# EAGLE design gamby-prototype2 (EAGLE 5.11)
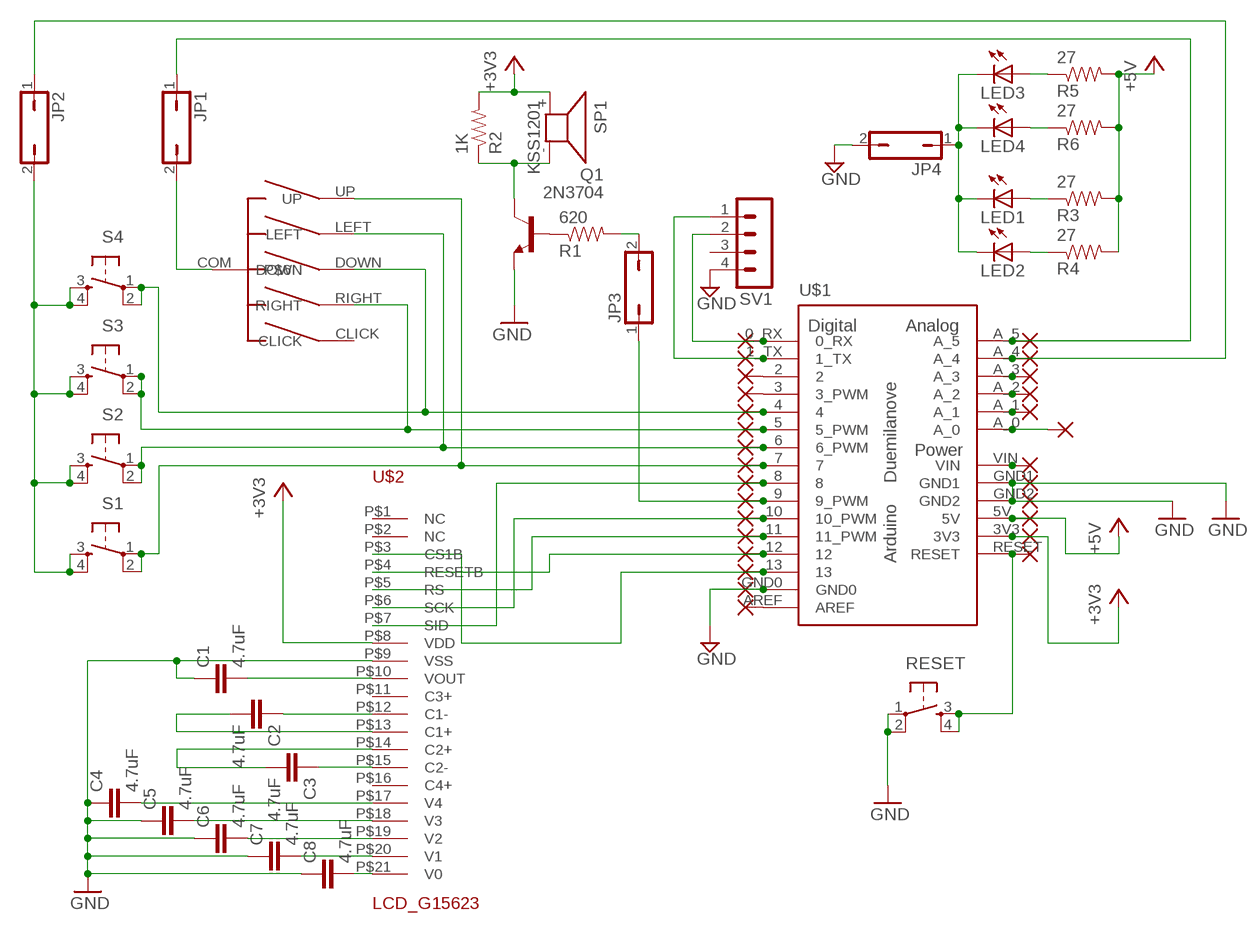
[diagram p0: schematic, sheet 1]

## Parts
C1  4.7uF  C2.5/2  [C2.5-2]
C2  4.7uF  C2.5/2  [C2.5-2]
C3  4.7uF  C2.5/2  [C2.5-2]
C4  4.7uF  C2.5/2  [C2.5-2]
C5  4.7uF  C2.5/2  [C2.5-2]
C6  4.7uF  C2.5/2  [C2.5-2]
C7  4.7uF  C2.5/2  [C2.5-2]
C8  4.7uF  C2.5/2  [C2.5-2]
JP1  JP1Q  [JP1]
JP2  JP1Q  [JP1]
JP3  JP1Q  [JP1]
JP4  JP1Q  [JP1]
LED1  LEDSMT1206  [1206]
LED2  LEDSMT1206  [1206]
LED3  LEDSMT1206  [1206]
LED4  LEDSMT1206  [1206]
PAD_3V3  1,6/0,8  [1,6/0,8]
PAD_5V  1,6/0,8  [1,6/0,8]
PAD_A0  1,6/0,8  [1,6/0,8]
PAD_A1  1,6/0,8  [1,6/0,8]
PAD_A2  1,6/0,8  [1,6/0,8]
PAD_A3  1,6/0,8  [1,6/0,8]
PAD_A4  1,6/0,8  [1,6/0,8]
PAD_A5  1,6/0,8  [1,6/0,8]
PAD_AREF  1,6/0,8  [1,6/0,8]
PAD_D2  1,6/0,8  [1,6/0,8]
PAD_D3  1,6/0,8  [1,6/0,8]
PAD_D4  1,6/0,8  [1,6/0,8]
PAD_D5  1,6/0,8  [1,6/0,8]
PAD_D6  1,6/0,8  [1,6/0,8]
PAD_D7  1,6/0,8  [1,6/0,8]
PAD_D8  1,6/0,8  [1,6/0,8]
PAD_D9  1,6/0,8  [1,6/0,8]
PAD_D10  1,6/0,8  [1,6/0,8]
PAD_D11  1,6/0,8  [1,6/0,8]
PAD_D12  1,6/0,8  [1,6/0,8]
PAD_D13  1,6/0,8  [1,6/0,8]
PAD_GND0  1,6/0,8  [1,6/0,8]
PAD_GND1  1,6/0,8  [1,6/0,8]
PAD_GND2  1,6/0,8  [1,6/0,8]
PAD_RESET  1,6/0,8  [1,6/0,8]
PAD_RX  1,6/0,8  [1,6/0,8]
PAD_TX  1,6/0,8  [1,6/0,8]
PAD_VIN  1,6/0,8  [1,6/0,8]
Q1  2N3704  [TO92]
R1  620  RESISTORPTH1  [AXIAL-0.3]
R2  1K  RESISTORPTH1  [AXIAL-0.3]
R3  27  RESISTORPTH1  [AXIAL-0.3]
R4  27  RESISTORPTH1  [AXIAL-0.3]
R5  27  RESISTORPTH1  [AXIAL-0.3]
R6  27  RESISTORPTH1  [AXIAL-0.3]
RESET  TAC_SWITCHPTH  [TACTILE-PTH]
S1  TAC_SWITCHPTH  [TACTILE-PTH]
S2  TAC_SWITCHPTH  [TACTILE-PTH]
S3  TAC_SWITCHPTH  [TACTILE-PTH]
S4  TAC_SWITCHPTH  [TACTILE-PTH]
SP1  KSS1201  [KSS1201]
SV1  MA04-1  [MA04-1]
U$1  ARDUINO-USBLONG_PADS_TEXT  [SHIELD]
U$2  LCD_G15623  [LCD_G15623]
U$3  DEV1  [DIP]

## Nets
0_RX: PAD_RX.1(P) SV1.2 U$1.0_RX
1_TX: PAD_TX.1(P) SV1.1 U$1.1_TX
+3V3: PAD_3V3.1(P) R2.P$2 SP1.+ U$1.3V3 U$2.P$8(VDD)
+5V: PAD_5V.1(P) R3.P$2 R4.P$2 R5.P$2 R6.P$2 U$1.5V
A0: PAD_A0.1(P) U$1.A_0
A4_BUTTONS: JP2.1 PAD_A4.1(P) U$1.A_4
A5_DPAD: JP1.1 PAD_A5.1(P) U$1.A_5
BUTTON_A: PAD_D7.1(P) S1.1 S1.2 U$1.7 U$3.UP
D2: PAD_D4.1(P) S4.1 S4.2 U$1.4 U$3.DOWN
D3: JP3.1 PAD_D9.1(P) U$1.9(9_PWM)
D4: PAD_D5.1(P) S3.1 S3.2 U$1.5(5_PWM) U$3.RIGHT
D5: PAD_D6.1(P) S2.1 S2.2 U$1.6(6_PWM) U$3.LEFT
GND: C1.1 C4.1 C5.1 C6.1 C7.1 C8.1 JP4.2 PAD_GND0.1(P) PAD_GND1.1(P) PAD_GND2.1(P) Q1.3(E) RESET.1 RESET.2 SV1.4 U$1.GND0 U$1.GND1 U$1.GND2 U$2.P$9(VSS)
N$1: PAD_D8.1(P) U$1.8 U$2.P$7(SID)
N$2: PAD_D10.1(P) U$1.10(10_PWM) U$2.P$6(SCK)
N$3: PAD_D11.1(P) U$1.11(11_PWM) U$2.P$5(RS)
N$4: PAD_D12.1(P) U$1.12 U$2.P$4(RESETB)
N$5: LED1.A R3.P$1
N$6: JP1.2 U$3.COM
N$7: LED2.A R4.P$1
N$8: JP4.1 LED1.C LED2.C LED3.C LED4.C
N$9: LED4.A R6.P$1
N$13: PAD_VIN.1(P) U$1.VIN
N$15: Q1.2(C) R2.P$1 SP1.-
N$17: Q1.1(B) R1.P$1
N$18: PAD_D3.1(P) U$1.3(3_PWM)
N$20: JP3.2 R1.P$2
N$21: C7.2 U$2.P$20(V1)
N$22: C5.2 U$2.P$18(V3)
N$23: C8.2 U$2.P$21(V0)
N$24: C4.2 U$2.P$17(V4)
N$25: PAD_D13.1(P) U$1.13 U$2.P$3(CS1B)
N$26: C6.2 U$2.P$19(V2)
N$28: PAD_D2.1(P) U$1.2
N$29: C3.1 U$2.P$15(C2-)
N$30: C3.2 U$2.P$14(C2+)
N$32: C2.2 U$2.P$13(C1+)
N$33: C2.1 U$2.P$12(C1-)
N$35: PAD_A1.1(P) U$1.A_1
N$36: C1.2 U$2.P$10(VOUT)
N$37: LED3.A R5.P$1
N$42: PAD_RESET.1(P) RESET.3 RESET.4 U$1.RESET
N$43: PAD_A2.1(P) U$1.A_2
N$44: PAD_A3.1(P) U$1.A_3
N$45: JP2.2 S1.3 S1.4 S2.3 S2.4 S3.3 S3.4 S4.3 S4.4
N$49: PAD_AREF.1(P) U$1.AREF
Unconnected: SV1.3 U$2.P$1(NC) U$2.P$2(NC) U$2.P$11(C3+) U$2.P$16(C4+) U$3.CLICK

## Library data of the parts
C1-C8 = capacitor-wima:C: CAPACITOR naming: grid - package width
JP1-JP4 = jumper:JP1Q: JUMPER
LED1-LED4 = led:LED: LED OSRAM: - CHIPLED LG R971, LG N971, LY N971, LG Q971, LY Q971, LO R971, LY R971 LH N974, LH R974 LS Q976, LO Q976, LY Q976 LO Q996 - Hyper CHIPLED LW Q18S LB Q993, LB Q99A, LB R99A - SideLED LS A670, LO A670, LY A670, LG A670, LP A670 LB A673, LV A673, LT A673, LW A673 LH A674 LY A675 LS A676, LA A676, LO A676, LY A676, LW A676 LS A679, LY A679, LG A679 - Hyper Micro SIDELED® LS Y876, LA Y876, LO Y876, LY Y876 LT Y87S - SmartLED LW L88C, LW L88S LB L89C, LB L89S, LG L890 LS L89K, LO L89K, LY L89K LS L896, LA L896, LO L896, LY L896 - TOPLED LS T670, LO T670, LY T670, LG T670, LP T670 LSG T670, LSP T670, LSY T670, LOP T670, LYG T670 LG T671, LOG T671, LSG T671 LB T673, LV T673, LT T673, LW T673 LH T674 LS T676, LA T676, LO T676, LY T676, LB T676, LH T676, LSB T676, LW T676 LB T67C, LV T67C, LT T67C, LS T67K, LO T67K, LY T67K, LW E67C LS E67B, LA E67B, LO E67B, LY E67B, LB E67C, LV E67C, LT E67C LW T67C LS T679, LY T679, LG T679 LS T770, LO T770, LY T770, LG T770, LP T770 LB T773, LV T773, LT T773, LW T773 LH T774 LS E675, LA E675, LY E675, LS T675 LS T776, LA T776, LO T776, LY T776, LB T776 LHGB T686 LT T68C, LB T68C - Hyper Mini TOPLED® LB M676 - Mini TOPLED Santana® LG M470 LS M47K, LO M47K, LY M47K Source: http://www.osram.convergy.de LUXEON: - LUMILED® LXK2-PW12-R00, LXK2-PW12-S00, LXK2-PW14-U00, LXK2-PW14-V00 LXK2-PM12-R00, LXK2-PM12-S00, LXK2-PM14-U00 LXK2-PE12-Q00, LXK2-PE12-R00, LXK2-PE12-S00, LXK2-PE14-T00, LXK2-PE14-U00 LXK2-PB12-K00, LXK2-PB12-L00, LXK2-PB12-M00, LXK2-PB14-N00, LXK2-PB14-P00, LXK2-PB14-Q00 LXK2-PR12-L00, LXK2-PR12-M00, LXK2-PR14-Q00, LXK2-PR14-R00 LXK2-PD12-Q00, LXK2-PD12-R00, LXK2-PD12-S00 LXK2-PH12-R00, LXK2-PH12-S00 LXK2-PL12-P00, LXK2-PL12-Q00, LXK2-PL12-R00 Source: www.luxeon.com KINGBRIGHT: KA-3528ASYC Source: www.kingbright.com
PAD_3V3 PAD_5V PAD_A0 PAD_A1-PAD_A5 PAD_AREF PAD_D2-PAD_D13 PAD_GND0 PAD_GND1 PAD_GND2 PAD_RESET PAD_RX PAD_TX PAD_VIN = wirepad:1,6/0,8: THROUGH-HOLE PAD
Q1 = transistor:2N3704: NPN TRANSISTOR
R1-R6 = SparkFun:RESISTOR: Resistor Basic schematic elements and footprints for 0603, 1206, and PTH 1/10th watt (small) resistors.
RESET S1-S4 = SparkFun:TAC_SWITCH: Momentary Switch Button commonly used for reset or general input. Spark Fun Electronics SKU : COM-00097
SP1 = buzzer:KSS1201: SPEAKER Source: Schukat
SV1 = con-lstb:MA04-1: PIN HEADER; OC_FARNELL: unknown; OC_NEWARK: unknown
U$1 = Arduino-Various:ARDUINO-USB: The Ardiuno Duemilanove Pinouts layoutet as a Bare Shield. v0.5 Also for Arduino Diecimila. This is designed as a Part and has no Outline in the Dimension Layer. The Outline, when present, is drawed at the tPlace / bPlace Layer. Library by Stephanie Lange, http://www.k-ita.de/~sl/
U$2 = goldlcd:LCD_G15623
U$3 = alps-5wayswitch:DEV1

## Board
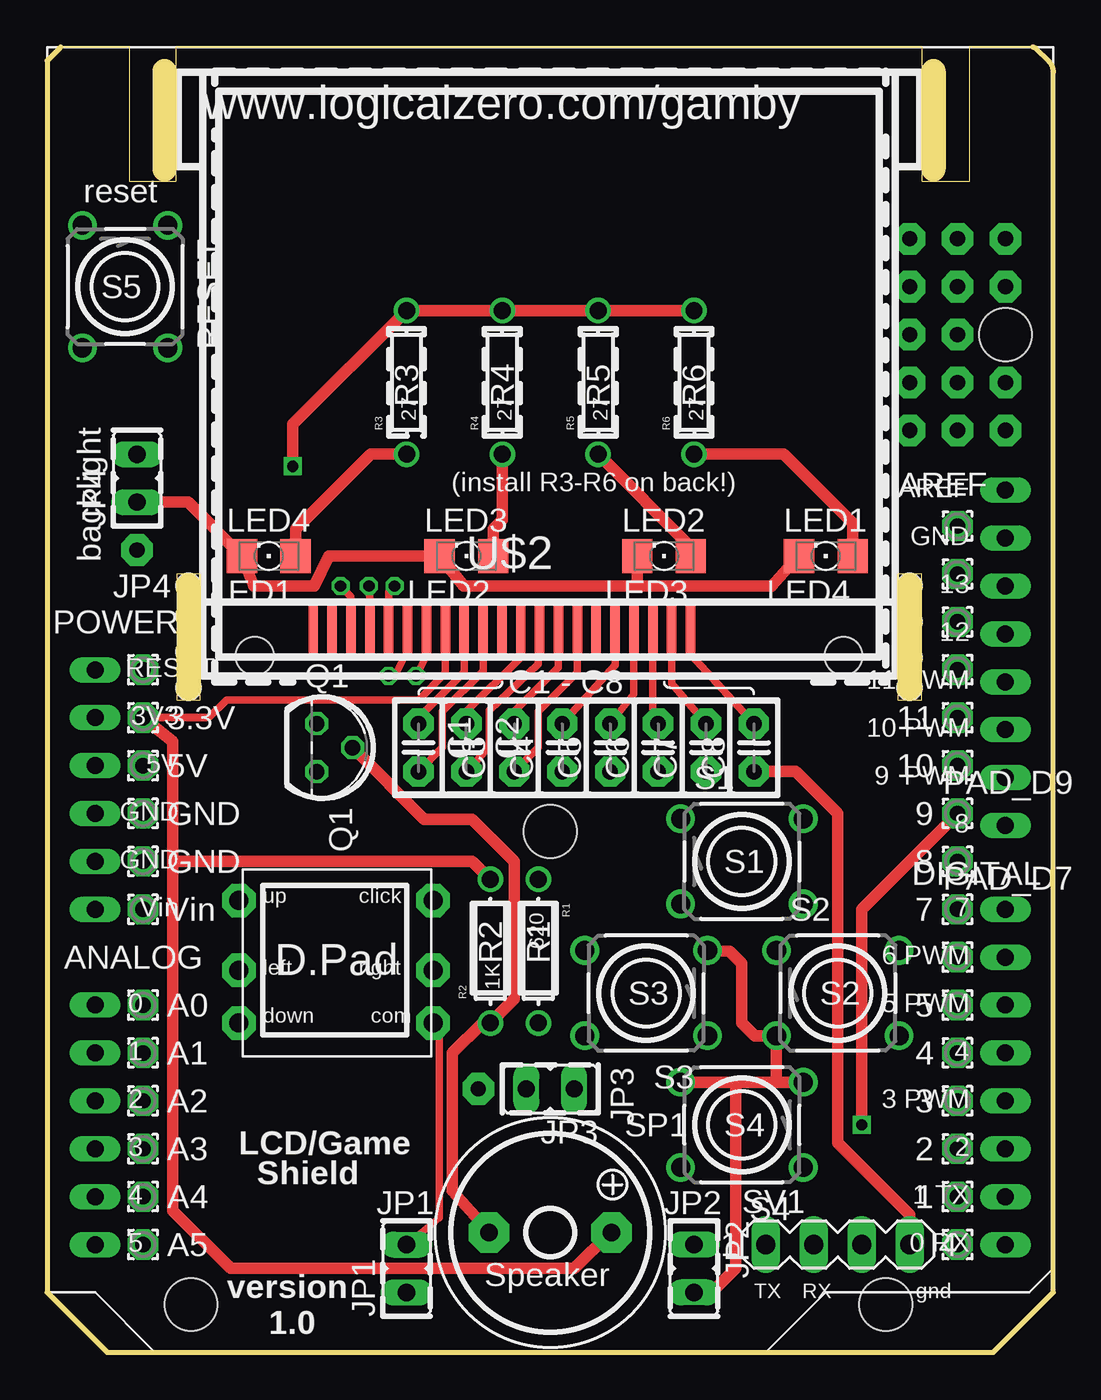
[diagram p1: board, top side]
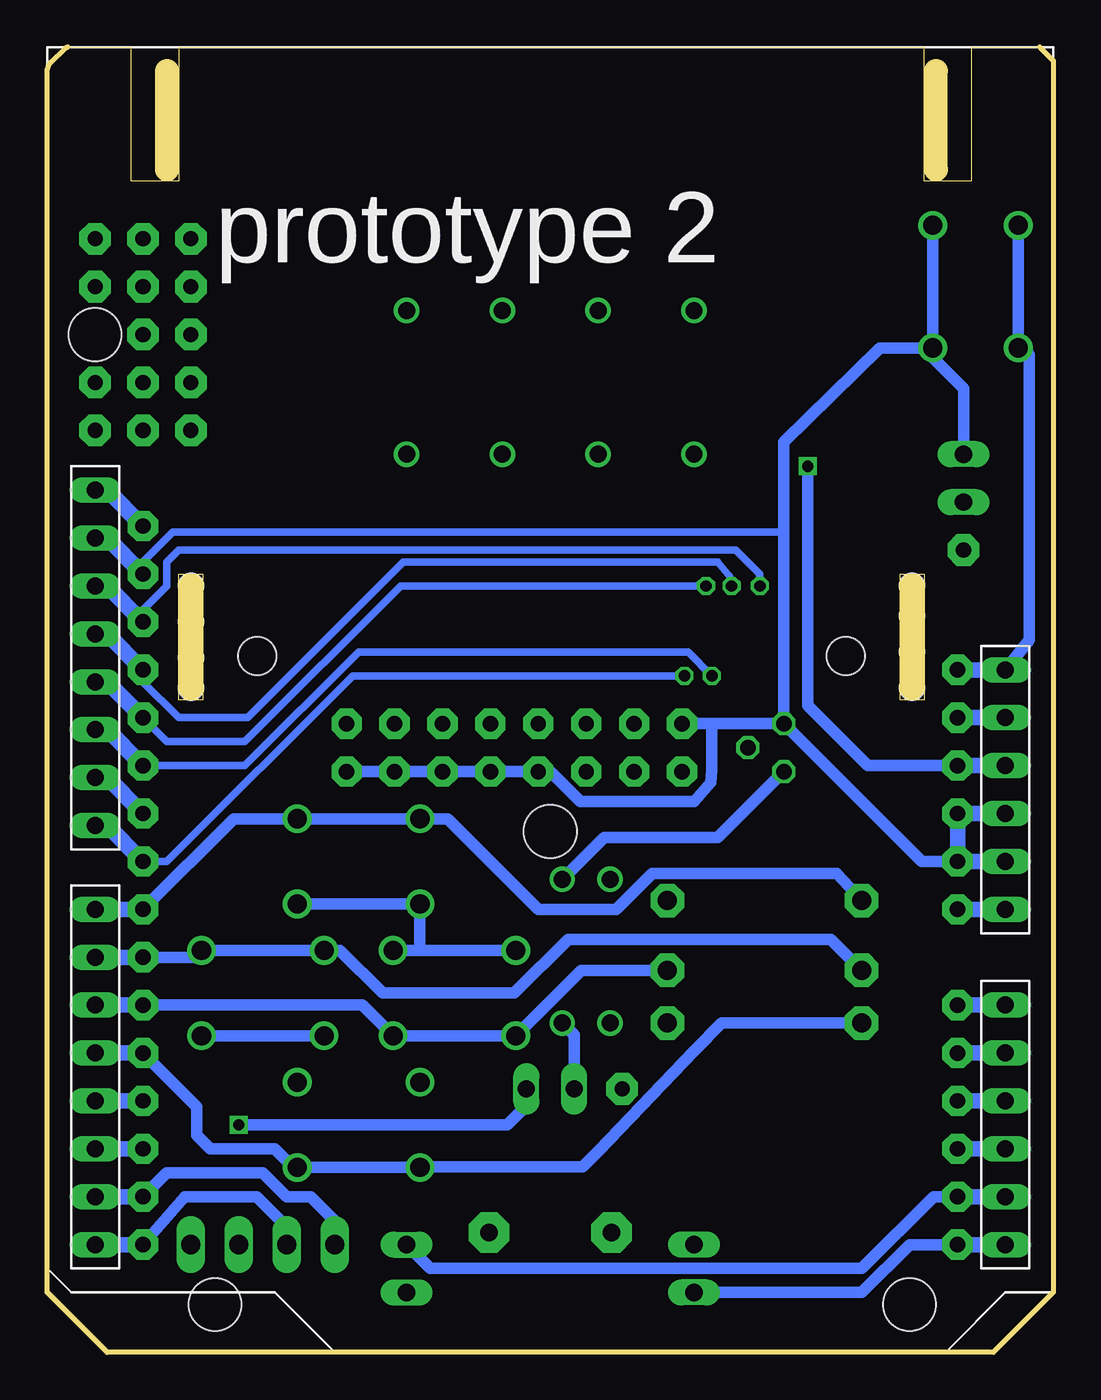
[diagram p2: board, bottom side, seen from below]

Size 53.34 x 69.22 mm. Coordinates in mm from the lower left corner, seen from the top.
Outline: 0,3.17 3.17,0 50.16,0 53.34,3.17 53.34,67.9 arc45 53.12,68.43 52.41,69.14 arc45 52.23,69.22 48.9,69.22 48.9,62.1 46.35,62.1 46.35,69.22 6.83,69.22 6.83,62.1 4.34,62.1 4.34,69.22 0.74,69.22 arc45 0.69,69.19 0.02,68.53 arc45 0,68.47 0,3.17
Copper layers (1*16): Top 0.0356mm / dielectric 1.5011mm / Bottom 0.0356mm
Design rules "LaenPCBOrder": minimum track width 6mil, minimum drill 13mil, track to track 6mil, track to pad 6mil, pad to pad 6mil, via to via 6mil, smd to smd 6mil, copper to edge 15mil, drill to drill 6mil, minimum pad ring 7mil, minimum via ring 7mil, stop-mask expansion 4mil, vias tented up to drill 0mil, thermal gap 10mil
Holes 2.8 mm at 50.8,53.98 44.45,2.54 7.62,2.54 26.67,27.62
Holes 1.3 mm at 7.49,35.24 7.49,40.64 7.49,39.05 7.49,37.15 45.72,35.24 45.72,40.64 45.72,36.83 45.72,38.73
Milling: 12 lines

### Footprints (pad centres in the part's own frame; a part is rotated, then mirrored left to right if it is on the bottom)
C2.5-2 = drill 0.813 pad 1.6 octagon: 1 -1.27,0; 2 1.27,0
JP1 = drill 0.914 long: 1 0,-1.27; 2 0,1.27
1206 = smd 1.6 x 1.803: A -1.422,0; C 1.422,0
1,6/0,8 = drill 0.813 pad 1.6 octagon: 1 0,0
TO92 = drill 0.813 octagon: 1 1.27,0; 2 0,1.905; 3 -1.27,0
AXIAL-0.3 = drill 0.9 round: P$1 -3.81,0; P$2 3.81,0
TACTILE-PTH = drill 1.016 round: 1 -3.251,2.261; 2 3.251,2.261; 3 -3.251,-2.261; 4 3.251,-2.261
KSS1201 = drill 0.914 pad 2.159 octagon: + 3.251,0; - -3.251,0
MA04-1 = drill 1.016 long: 1 -3.81,0; 2 -1.27,0; 3 1.27,0; 4 3.81,0
SHIELD = drill 0.9 pad 1.27 long: 0_RX -25.4,27.94; 1_TX -25.4,25.4; 2 -25.4,22.86; 3 -25.4,20.32; 3V3 22.86,0; 4 -25.4,17.78; 5 -25.4,15.24; 5V 22.86,2.54; 6 -25.4,12.7; 7 -25.4,10.16; 8 -25.4,5.715; 9 -25.4,3.175; 10 -25.4,0.635; 11 -25.4,-1.905; 12 -25.4,-4.445; 13 -25.4,-6.985; A_0 22.86,15.24; A_1 22.86,17.78; A_2 22.86,20.32; A_3 22.86,22.86; A_4 22.86,25.4; A_5 22.86,27.94; AREF -25.4,-12.065; GND0 -25.4,-9.525; GND1 22.86,7.62; GND2 22.86,5.08; RESET 22.86,-2.54; VIN 22.86,10.16
LCD_G15623 = smd 0.5 x 3: P$1 5.85,2.5; P$2 6.85,2.5; P$3 7.85,2.5; P$4 8.85,2.5; P$5 9.85,2.5; P$6 10.85,2.5; P$7 11.85,2.5; P$8 12.85,2.5; P$9 13.85,2.5; P$10 14.85,2.5; P$11 15.85,2.5; P$12 16.85,2.5; P$13 17.85,2.5; P$14 18.85,2.5; P$15 19.85,2.5; P$16 20.85,2.5; P$17 21.85,2.5; P$18 22.85,2.5; P$19 23.85,2.5; P$20 24.85,2.5; P$21 25.85,2.5 | hole 2: 2.75,1.05; 33.95,1.05
DIP = drill 1 pad 1.778 octagon: CLICK 10.3,6.5; COM 10.3,0; DOWN 0,0; LEFT 0,2.8; RIGHT 10.3,2.8; UP 0,6.5

### Placement (x,y rotation side)
C1  19.68,32.07 270 top
C2  22.23,32.07 270 top
C3  24.77,32.07 90 top
C4  27.3,32.07 90 top
C5  29.84,32.07 90 top
C6  32.38,32.07 90 top
C7  34.92,32.07 90 top
C8  37.47,32.07 90 top
JP1  19.05,4.45 0 top
JP2  34.29,4.45 180 top
JP3  26.67,13.97 90 top
JP4  4.76,46.35 0 top
LED1  11.75,42.23 180 top
LED2  22.23,42.23 180 top
LED3  32.7,42.23 180 top
LED4  41.27,42.23 180 top
PAD_3V3  5.08,33.66 0 top
PAD_5V  5.08,31.12 0 top
PAD_A0  5.08,18.42 0 top
PAD_A1  5.08,15.88 0 top
PAD_A2  5.08,13.33 0 top
PAD_A3  5.08,10.79 0 top
PAD_A4  5.08,8.26 0 top
PAD_A5  5.08,5.71 0 top
PAD_AREF  48.26,43.81 0 top
PAD_D2  48.26,10.79 0 top
PAD_D3  48.26,13.33 0 top
PAD_D4  48.26,15.88 0 top
PAD_D5  48.26,18.42 0 top
PAD_D6  48.26,20.96 0 top
PAD_D7  48.26,23.5 0 top
PAD_D8  48.26,26.04 0 top
PAD_D9  48.26,28.58 0 top
PAD_D10  48.26,31.12 0 top
PAD_D11  48.26,33.66 0 top
PAD_D12  48.26,36.2 0 top
PAD_D13  48.26,38.73 0 top
PAD_GND0  48.26,41.27 0 top
PAD_GND1  5.08,26.04 0 top
PAD_GND2  5.08,28.58 0 top
PAD_RESET  5.08,36.2 0 top
PAD_RX  48.26,5.71 0 top
PAD_TX  48.26,8.26 0 top
PAD_VIN  5.08,23.5 0 top
Q1  14.29,32.07 270 top
R1  26.04,21.27 270 top
R2  23.5,21.27 90 top
R3  19.05,51.43 90 top
R4  24.13,51.43 90 top
R5  29.21,51.43 90 top
R6  34.29,51.43 90 top
RESET  4.13,56.52 270 top
S1  36.83,26.04 0 top
S2  41.91,19.05 0 top
S3  31.75,19.05 180 top
S4  36.83,12.06 180 top
SP1  26.67,6.35 0 top
SV1  41.91,5.71 0 top
U$1  25.4,33.66 180 top
U$2  8.26,35.88 0 top
U$3  10.16,17.46 0 top

### Tracks (layer width: path | path; a pad name or v marks a point on that pad's centre or on a via)
0_RX
  Bottom 0.61: SV1.2 40.64,6.67 42.23,8.26 46.04,8.26 PAD_RX.1
  Bottom 0.813: PAD_RX.1 U$1.0_RX
1_TX
  Bottom 0.61: SV1.1 38.1,6.98 39.37,8.26 40.64,8.26 41.91,9.53 46.99,9.53 PAD_TX.1
  Bottom 0.813: PAD_TX.1 U$1.1_TX
+3V3
  Top 0.406: U$2.P$8 21.11,36.03 19.68,34.61 9.53,34.61 8.57,33.66 PAD_3V3.1
  Top 0.61: PAD_3V3.1 6.67,32.38 6.67,26.04 | SP1.+ 29.84,6.35 27.94,4.45 9.73,4.45 6.67,7.51 6.67,26.04 | 6.67,26.04 22.54,26.04 R2.P$2
  Bottom 0.813: PAD_3V3.1 U$1.3V3
+5V  (via drill 0.6)
  Top 0.61: v13.02,46.99 13.02,49.21 R3.P$2 R4.P$2 R5.P$2 R6.P$2
  Bottom 0.61: PAD_5V.1 9.84,31.12 13.02,34.29 v13.02,46.99
  Bottom 0.813: U$1.5V PAD_5V.1
A0
  Bottom 0.813: U$1.A_0 PAD_A0.1
A4_BUTTONS
  Bottom 0.61: PAD_A4.1 6.35,8.26 10.16,4.45 33.02,4.45 JP2.1
  Bottom 0.813: U$1.A_4 PAD_A4.1
A5_DPAD
  Bottom 0.61: PAD_A5.1 7.62,5.71 10.16,3.17 JP1.1
  Bottom 0.813: U$1.A_5 PAD_A5.1
BUTTON_A
  Bottom 0.61: U$3.UP 11.49,25.4 21.27,25.4 23.18,23.5 27.3,23.5 32.11,28.3 S1.1 S1.2 43.46,28.3 PAD_D7.1
  Bottom 0.813: PAD_D7.1 U$1.7
D2
  Bottom 0.61: U$3.DOWN 17.59,17.46 19.05,16 24.13,10.67 24.96,9.84 33.54,9.84 S4.2 S4.1 40.28,9.8 41.27,10.79 44.69,10.79 45.4,11.5 45.4,13.02 PAD_D4.1
  Bottom 0.813: PAD_D4.1 U$1.4
D3  (via drill 0.6)
  Top 0.61: PAD_D9.1 43.18,23.5 v43.18,12.06
  Bottom 0.61: v43.18,12.06 28.94,12.06 27.94,13.07 JP3.1
  Bottom 0.813: U$1.9 50.16,30.48 PAD_D9.1
D4
  Bottom 0.61: U$3.RIGHT 25.03,20.26 S3.2 S3.1 36.63,18.42 PAD_D5.1
  Bottom 0.813: PAD_D5.1 U$1.5
D5
  Bottom 0.61: U$3.LEFT 11.8,21.91 25.72,21.91 28.57,19.05 35.56,19.05 37.82,21.31 S2.1 S2.2 45.52,20.96 PAD_D6.1
  Bottom 0.813: PAD_D6.1 U$1.6
GND
  Top 0.406: C1.1 19.68,33.66 22.11,36.07 U$2.P$9
  Top 0.61: SV1.4 45.72,7.3 41.91,11.11 41.91,28.58 39.69,30.8 C8.1
  Bottom 0.406: 6.39,53.98 6.35,53.94 | C1.1 19.68,33.6 | PAD_GND0.1 48.26,41.91 46.67,43.5 14.29,43.5
  Bottom 0.61: RESET.1 6.39,53.98 RESET.2 6.91,53.26 | 6.91,53.26 9.21,53.26 14.29,48.26 14.29,43.5 Q1.3 | C8.1 C7.1 C6.1 C5.1 C4.1 26.67,30.8 25.08,29.21 19.05,29.21 18.15,30.22 18.1,30.85 18.1,33.34 | Q1.3 18.1,33.34 | PAD_GND1.1 6.99,26.04 Q1.3 | 18.1,33.34 C1.1 | JP4.2 4.76,51.12 6.91,53.26
  Bottom 0.813: PAD_GND0.1 50.16,43.18 U$1.GND0 | U$1.GND1 PAD_GND1.1 PAD_GND2.1 U$1.GND2
N$1  (via drill 0.6)
  Top 0.406: v19.56,35.88 20.11,36.93 U$2.P$7
  Bottom 0.406: PAD_D8.1 46.99,26.04 37.15,35.88 v19.56,35.88
  Bottom 0.813: PAD_D8.1 50.16,27.94 U$1.8
N$2  (via drill 0.6)
  Top 0.406: v18.1,35.88 18.41,35.88 19.05,37.15 19.05,39.59 U$2.P$6
  Bottom 0.406: v18.1,35.88 19.37,37.15 36.83,37.15 42.86,31.12 PAD_D10.1
  Bottom 0.813: U$1.10 50.16,33.02 PAD_D10.1
N$3  (via drill 0.6)
  Top 0.406: 18.1,38.38 U$2.P$5 18.11,40.33 v18.41,40.64
  Bottom 0.406: PAD_D11.1 46.99,32.38 42.86,32.38 34.61,40.64 v18.41,40.64
  Bottom 0.813: U$1.11 50.16,35.56 PAD_D11.1
N$4  (via drill 0.6)
  Top 0.406: v17.06,40.64 17.11,39.96 U$2.P$4
  Bottom 0.406: v17.06,40.64 17.14,41.15 17.78,41.91 34.46,41.91 42.71,33.66 46.35,33.66 48.26,35.56 PAD_D12.1
  Bottom 0.813: PAD_D12.1 50.16,38.1 U$1.12
N$5
  Top 0.406: 13.17,42.06 LED1.A 13.17,43.02
  Top 0.61: R3.P$1 17.14,47.62 13.17,43.65 13.17,43.02
N$6
  Top 0.406: U$3.COM 20.78,17.46 20.78,7.12 JP1.2
N$7
  Top 0.406: LED2.A 23.81,42.23
  Top 0.61: LED2.A 23.65,43.66 24.13,44.13 R4.P$1
N$8
  Top 0.61: 31.28,40.64 38.42,40.64 39.69,42.08 39.52,42.23 LED4.C | 31.28,40.64 LED3.C | 31.28,40.64 22.07,40.64 LED2.C 14.92,42.23 14.16,40.64 10.96,40.64 LED1.C 7.47,45.09 JP4.1
N$9
  Top 0.406: 42.7,43.03 LED4.A
  Top 0.61: R6.P$1 39.05,47.62 42.7,43.98 42.7,43.03
N$11  (via drill 0.8 pad 1.68)
  other vias: 50.8,59.05
N$12  (via drill 0.8 pad 1.68)
  other vias: 4.76,42.54
N$13
  Bottom 0.813: U$1.VIN PAD_VIN.1
N$15
  Top 0.61: SP1.- 23.42,6.43 21.46,8.57 21.46,15.88 23.1,17.46 R2.P$1 24.77,18.73 24.77,26.04 22.54,28.26 20,28.26 Q1.2
N$16  (via drill 0.8 pad 1.68)
  other vias: 48.26,51.43
N$17
  Bottom 0.61: R1.P$1 23.81,27.31 17.78,27.31 Q1.1
N$18
  Bottom 0.813: PAD_D3.1 U$1.3
N$19  (via drill 0.8 pad 1.68)
  other vias: 48.26,53.98
N$20
  Bottom 0.61: JP3.2 25.4,16.83 R1.P$2
N$21
  Top 0.406: C7.2 33.1,35.48 U$2.P$20
N$22
  Top 0.406: C5.2 31.11,34.91 U$2.P$18
N$23
  Top 0.406: C8.2 34.1,37.02 U$2.P$21
N$24
  Top 0.406: C4.2 30.11,36.45 U$2.P$17
N$25  (via drill 0.6)
  Top 0.406: v15.56,40.64 16.11,40.09 U$2.P$3
  Bottom 0.406: PAD_D13.1 48.26,39.37 46.99,40.64 46.99,41.91 46.35,42.54 16.83,42.54 15.56,41.27 v15.56,40.64
  Bottom 0.813: PAD_D13.1 50.16,40.64 U$1.13
N$26
  Top 0.406: C6.2 32.1,34.01 U$2.P$19
N$27  (via drill 0.8 pad 1.68)
  other vias: 50.8,51.43
N$28
  Bottom 0.813: PAD_D2.1 U$1.2
N$29
  Top 0.406: C3.1 26.04,32.07 26.04,33.97 28.11,36.04 U$2.P$15
N$30
  Top 0.406: C3.2 24.77,33.97 27.11,36.31 U$2.P$14
N$31  (via drill 0.8 pad 1.68)
  other vias: 45.72,48.89
N$32
  Top 0.406: C2.2 22.54,31.12 23.44,32.14 23.44,34.04 26.04,36.51 U$2.P$13
N$33
  Top 0.406: C2.1 22.23,33.97 25.11,36.85 U$2.P$12
N$34  (via drill 0.8 pad 1.68)
  other vias: 50.8,48.89
N$35
  Bottom 0.813: U$1.A_1 PAD_A1.1
N$36
  Top 0.406: C1.2 20.95,32.07 20.95,33.97 23.11,36.12 U$2.P$10
N$37
  Top 0.61: R5.P$1 34.12,42.71 LED3.A
N$38  (via drill 0.8 pad 1.68)
  other vias: 45.72,53.98
N$39  (via drill 0.8 pad 1.68)
  other vias: 45.72,56.52
N$40  (via drill 0.8 pad 1.68)
  other vias: 45.72,59.05
N$41  (via drill 0.8 pad 1.68)
  other vias: 48.26,59.05
N$42
  Bottom 0.61: RESET.3 RESET.4 1.27,52.91 1.27,37.78 U$1.RESET
  Bottom 0.813: U$1.RESET PAD_RESET.1
N$43
  Bottom 0.813: U$1.A_2 PAD_A2.1
N$44
  Bottom 0.813: U$1.A_3 PAD_A3.1
N$45
  Top 0.61: 38.66,14.33 S4.3 | 36.51,14.33 S4.4 | 38.66,14.33 S2.3 37.5,16.79 36.83,17.46 36.83,20.64 36.2,21.27 S3.3 | JP2.2 35.24,3.17 36.51,4.45 36.51,14.33 | 36.51,14.33 38.66,14.33
  Bottom 0.61: S1.4 S1.3 33.58,21.31 | S2.3 S2.4 | 33.58,21.31 S3.4 | S3.3 33.58,21.31
N$48  (via drill 0.8 pad 1.68)
  other vias: 48.26,56.52
N$49
  Bottom 0.813: U$1.AREF 50.16,45.72 PAD_AREF.1
N$52  (via drill 0.8 pad 1.68)
  other vias: 50.8,56.52
N$53  (via drill 0.8 pad 1.68)
  other vias: 45.72,51.43
N$54  (via drill 0.8 pad 1.68)
  other vias: 22.86,13.97
N$55  (via drill 0.8 pad 1.68)
  other vias: 48.26,48.89

### Text on the board
tStop: www.logicalzero.com/gamby | Gamby
_tsilk: www.logicalzero.com/gamby | reset | S5 | R3 | R4 | R5 | R6 | (install R3-R6 on back!) | AREF | LED4 | LED3 | LED2 | LED1 | backlight | JP4 | Q1 | C1 - C8 | 11 | 3.3V | 10 | 5V | 9 | GND | 8 | GND | S1 | 7 | Vin | R2 | R1 | D.Pad | S3 | S2 | 5 | A0 | 4 | A1 | 3 | A2 | JP3 | S4 | 2 | A3 | LCD/Game | Shield | 1 | A4 | JP1 | JP2 | A5 | Speaker | version | TX | RX | gnd | 1.0
_bsilk: prototype 2